# Altium schematic sheet [06] - Multiplexer.SchDoc
size A4
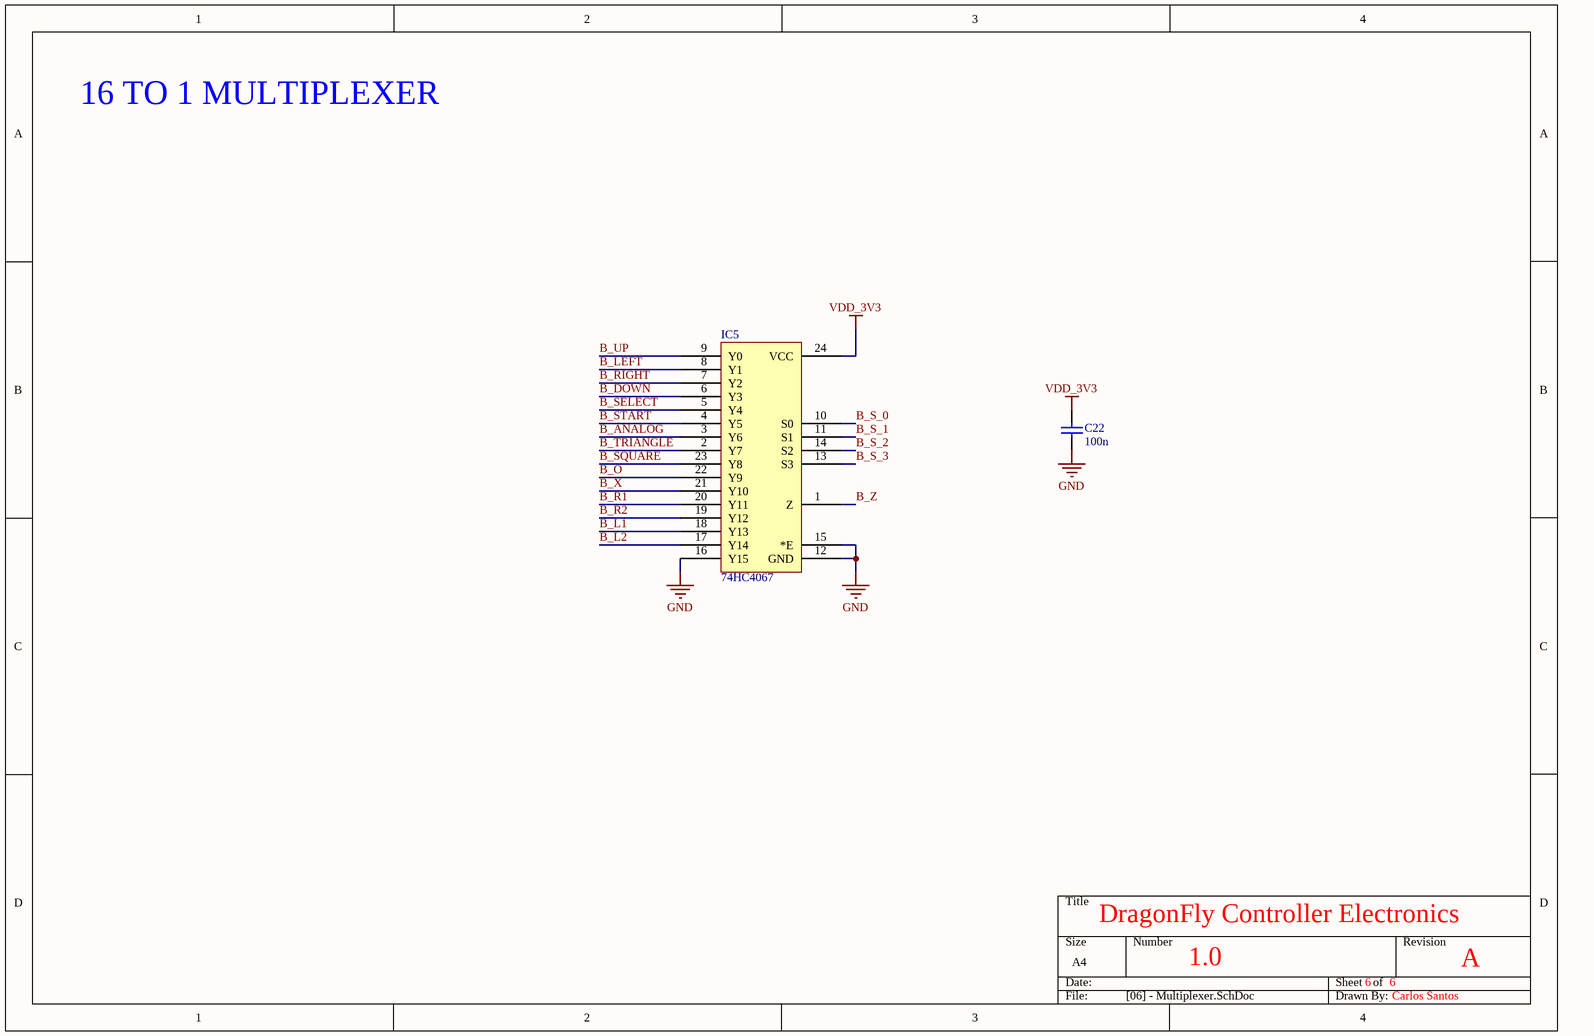
[diagram p0: [06] - Multiplexer.SchDoc]

## Parts
C22  value 100n  [0402 - Capacitor]  (hidden comment: Capacitor)
IC5  74HC4067  [74HC4067-QFN50P350X550X100_HS-25N]

## Nets
GND: C22.1 IC5.12(GND) IC5.15(*E) IC5.16(Y15)
VDD_3V3: C22.2 IC5.24(VCC)
B_ANALOG: IC5.3(Y6)
B_DOWN: IC5.6(Y3)
B_L1: IC5.18(Y13)
B_L2: IC5.17(Y14)
B_LEFT: IC5.8(Y1)
B_O: IC5.22(Y9)
B_R1: IC5.20(Y11)
B_R2: IC5.19(Y12)
B_RIGHT: IC5.7(Y2)
B_S_0: IC5.10(S0)
B_S_1: IC5.11(S1)
B_S_2: IC5.14(S2)
B_S_3: IC5.13(S3)
B_SELECT: IC5.5(Y4)
B_SQUARE: IC5.23(Y8)
B_START: IC5.4(Y5)
B_TRIANGLE: IC5.2(Y7)
B_UP: IC5.9(Y0)
B_X: IC5.21(Y10)
B_Z: IC5.1(Z)

## Notes on the sheet
- 16 TO 1 MULTIPLEXER
- DragonFly Controller Electronics
- 1.0
- 6
- A
- Carlos Santos

## Library data of the parts
IC5 = 74HC4067: DigiKey Part #: 1727-6606-1-ND